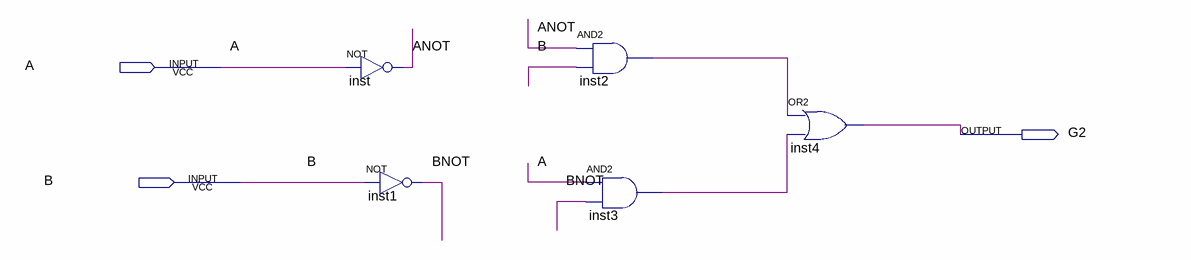
[diagram p0: schematic sheet]
// Quartus schematic Lab03G2.bdf as structural Verilog: 5 symbols, 3 pins
module Lab03G2 (
  input  A,
  input  B,
  output G2
);

  wire ANOT, BNOT, inst2_out, inst3_out;

  not inst (ANOT, A);
  not inst1 (BNOT, B);
  and inst2 (inst2_out, ANOT, B);
  and inst3 (inst3_out, A, BNOT);
  or inst4 (G2, inst2_out, inst3_out);
endmodule
